# Altium schematic sheet FEXL1513A-220M1_FEXL1513A-220M.schdoc.schdoc
size 127 x 101 mm
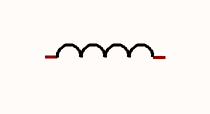
[diagram p0: FEXL1513A-220M1_FEXL1513A-220M.schdoc.schdoc]

## Parts
L?  FEXL1513A-220M  [IND-SMD_L16.5-W15.5]  (value not drawn)

## Nets

Not connected (* = marked no-connect by the designer): L? 1 2

## Library data of the parts
L? = FEXL1513A-220M: Manufacturer: cjiang(长江微电); Add into BOM: yes; Value: 22uH; Tolerance: ±20%; Rated Current: 17A; Saturation Current (Isat): 22A; DC Resistance (DCR): 13.86mΩ; Type: 一体成型电感; Symbol: FEXL1513A-220M; Device: FEXL1513A-220M; LCSC Part Name: 22uH ±20% 22A; Supplier Part: C5378604; Manufacturer Part: FEXL1513A-220M; Supplier Footprint: SMD,16.5x15.5x12.7mm(1513); JLCPCB Part Class: Extended Part; Datasheet: https://atta.szlcsc.com/upload/public/pdf/source/20230406/FF57C09F52BFC355BADE8D0321BD05F5.pdf; Supplier: LCSC; Convert to PCB: yes; Ratings: AEC-Q200